# EAGLE design Main Board (EAGLE 9.2.2)
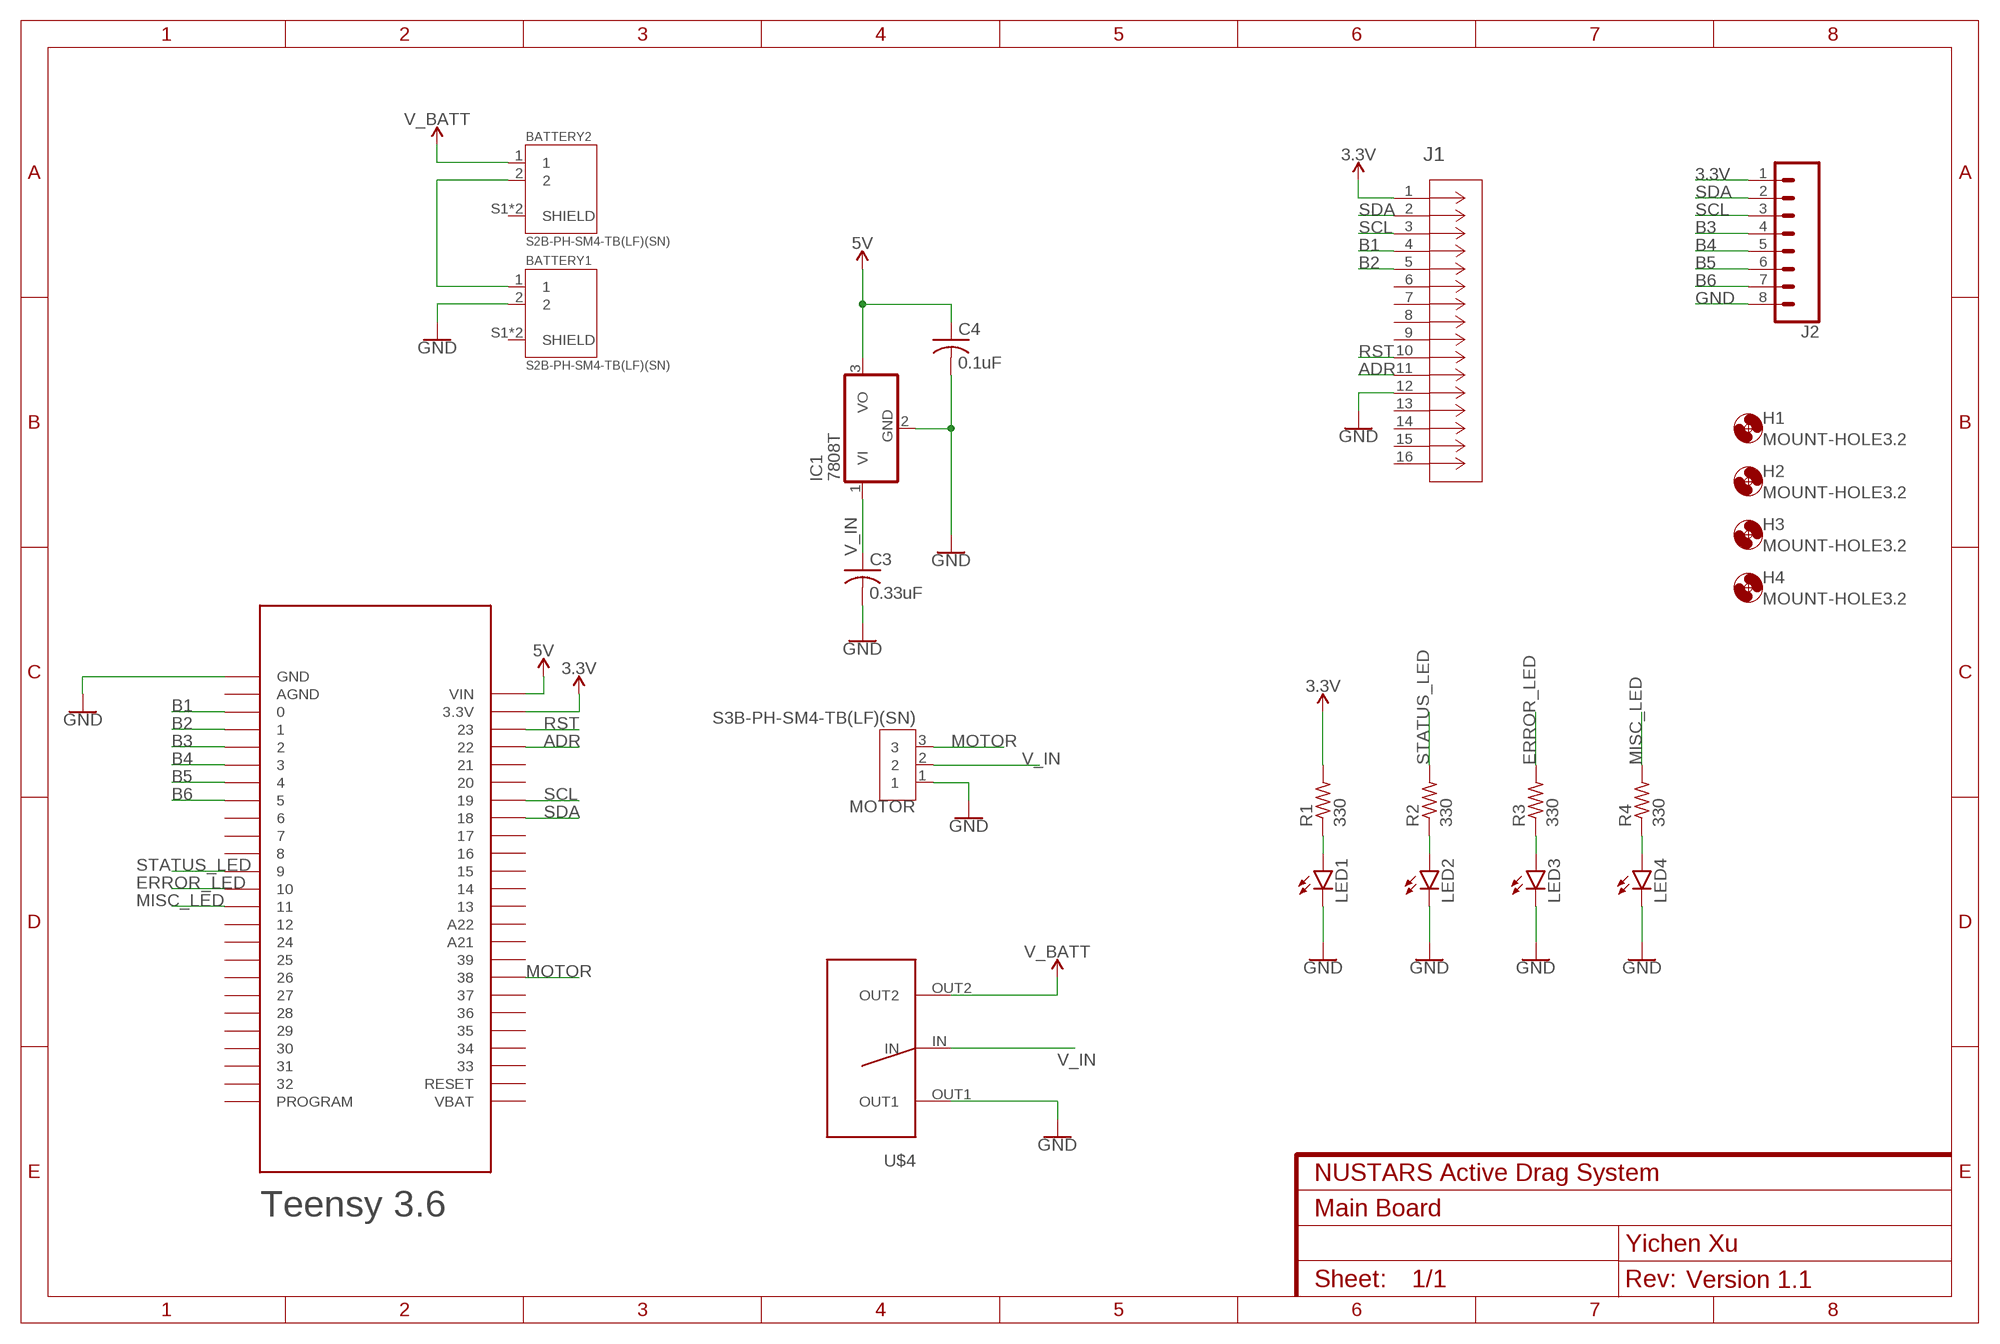
[diagram p0: schematic, sheet 1]
FRAME1 (FRAME-A4L): CNAME: NUSTARS Active Drag System; CREVISION: Version 1.1; DESIGNER: Yichen Xu

## Parts
BATTERY1  S2B-PH-SM4-TB(LF)(SN)  [JST_S2B-PH-SM4-TB(LF)(SN)]
BATTERY2  S2B-PH-SM4-TB(LF)(SN)  [JST_S2B-PH-SM4-TB(LF)(SN)]
C3  0.33uF  C-USC0805  [C0805]
C4  0.1uF  C-USC0805  [C0805]
H1  MOUNT-HOLE3.2  [3,2]
H2  MOUNT-HOLE3.2  [3,2]
H3  MOUNT-HOLE3.2  [3,2]
H4  MOUNT-HOLE3.2  [3,2]
IC1  7808T  [TO220H]
J1  62674-121121ALF  [CON12_1X12_DUT_58XF]
J2  CONN_08"  [1X08]
LED1  LEDSML0805  [SML0805]
LED2  LEDSML0805  [SML0805]
LED3  LEDSML0805  [SML0805]
LED4  LEDSML0805  [SML0805]
MOTOR  S3B-PH-SM4-TB(LF)(SN)  [JST_S3B-PH-SM4-TB(LF)(SN)]
R1  330  R-US_R0805  [R0805]
R2  330  R-US_R0805  [R0805]
R3  330  R-US_R0805  [R0805]
R4  330  R-US_R0805  [R0805]
U$1  TEENSY3.6  [TEENSY3.6]
U$4  SLIDE_SWITCH2  [SLIDE_SWITCH2]

## Nets
3.3V: J1.1 J2.1 R1.2 U$1.3.3V0(3.3V) U$1.3.3V1(3.3V) U$1.3.3V2(3.3V)
5V: C4.1 IC1.3(VO) U$1.VIN
ADR: J1.11 U$1.P22
B1: J1.4 U$1.P0
B2: J1.5 U$1.P1
B3: J2.4 U$1.P2
B4: J2.5 U$1.P3
B5: J2.6 U$1.P4
B6: J2.7 U$1.P5
ERROR_LED: R3.2 U$1.P10
GND: BATTERY1.2 C3.2 C4.2 IC1.2(GND) J1.12 J2.8 LED1.C LED2.C LED3.C LED4.C MOTOR.1 U$1.GND U$1.GND0(GND) U$1.GND2(GND) U$4.OUT1
MISC_LED: R4.2 U$1.P11
MOTOR: MOTOR.3 U$1.P38
N$1: LED1.A R1.1
N$2: BATTERY1.1 BATTERY2.2
N$4: LED2.A R2.1
N$5: LED3.A R3.1
N$6: LED4.A R4.1
RST: J1.10 U$1.P23
SCL: J1.3 J2.3 U$1.P19
SDA: J1.2 J2.2 U$1.P18
STATUS_LED: R2.2 U$1.P9
V_BATT: BATTERY2.1 U$4.OUT2
V_IN: C3.1 IC1.1(VI) MOTOR.2 U$4.IN
Unconnected: BATTERY1.S1(SHIELD) BATTERY1.S2(SHIELD) BATTERY2.S1(SHIELD) BATTERY2.S2(SHIELD) J1.6 J1.7 J1.8 J1.9 J1.13 J1.14 J1.15 J1.16 U$1.A21 U$1.A22 U$1.AGND U$1.P6 U$1.P7 U$1.P8 U$1.P12 U$1.P13 U$1.P14 U$1.P15 U$1.P16 U$1.P17 U$1.P20 U$1.P21 U$1.P24 U$1.P25 U$1.P26 U$1.P27 U$1.P28 U$1.P29 U$1.P30 U$1.P31 U$1.P32 U$1.P33 U$1.P34 U$1.P35 U$1.P36 U$1.P37 U$1.P39 U$1.PROGRAM U$1.RESET U$1.VBAT

## Library data of the parts
BATTERY1 BATTERY2 = S2B-PH-SM4-TB_LF__SN_:S2B-PH-SM4-TB(LF)(SN): PH Series 2 Position 2 mm Pitch Surface Mount Side Entry Shrouded Header; DESCRIPTION: PH Series 2 Position 2 mm Pitch Surface Mount Side Entry Shrouded Header; DIGI-KEY_PART_NUMBER: 455-1749-1-ND; DIGI-KEY_PURCHASE_URL: https://www.digikey.com/product-detail/en/jst-sales-america-inc/S2B-PH-SM4-TB_LF__SN_/455-1749-1-ND/926846?utm_source=snapeda&utm_medium=aggregator&utm_campaign=symbol; MF: JST Sales; MP: S2B-PH-SM4-TB_LF__SN_; PACKAGE: FakePackage u
C3 C4 = resistor:C-US: CAPACITOR, American symbol
H1-H4 = holes:MOUNT-HOLE: MOUNTING HOLE with drill center marker
IC1 = adafruit:78*: Positive VOLTAGE REGULATOR Added bigger pads to the TO-92 package
J1 = NUSTARS ADS Library:62674-121121ALF; MANUFACTURER_PART_NUMBER: 62674121121ALF; VENDOR: FCI
J2 = SparkFun-Connectors:CONN_08: Multi connection point. Often used as Generic Header-pin footprint for 0.1 inch spaced/style header connections On any of the 0.1 inch spaced packages, you can populate with these: Break Away Headers - Straight <https://www.sparkfun.com/products/116> (PRT-00116) Break Away Male Headers - Right Angle <https://www.sparkfun.com/products/553> (PRT-00553) Female Headers <https://www.sparkfun.com/products/115> (PRT-00115) Break Away Headers - Machine Pin <https://www.sparkfun.com/products/117> (PRT-00117) Break Away Female Headers - Swiss Machine Pin <https://www.sparkfun.com/products/743> (PRT-00743) Arduino Stackable Header - 8 Pin <https://www.sparkfun.com/products/9279> (PRT-09279) For SCREWTERMINALS and SPRING TERMINALS visit here: Screw Terimnals on SparkFun.com <https://www.sparkfun.com/search/results?term=Screw+Terminals> (5mm/3.5mm/2.54mm spacing) This device is also useful as a general connection point to wire up your design to another part of your project. Our various solder wires solder well into these plated through hole pads. Hook-Up Wire - Assortment (Stranded, 22 AWG) <https://www.sparkfun.com/products/11375> (PRT-11375) Hook-Up Wire - Assortment (Solid Core, 22 AWG) <https://www.sparkfun.com/products/11367> (PRT-11367) View the entire wire category on our website here <https://www.sparkfun.com/categories/141> Special notes: Molex polarized connector foot print use with SKU : PRT-08231 with associated crimp pins and housings. 1MM SMD Version SKU: PRT-10208 NOTES ON THE VARIANTS LOCK and LOCK_LONGPADS... This footprint was designed to help hold the alignment of a through-hole component (i.e. 6-pin header) while soldering it into place. You may notice that each hole has been shifted either up or down by 0.005 of an inch from it's more standard position (which is a perfectly straight line). This slight alteration caused the pins (the squares in the middle) to touch the edges of the holes. Because they are alternating, it causes a "brace" to hold the component in place. 0.005 has proven to be the perfect amount of "off-center" position when using our standard breakaway headers. Although looks a little odd when you look at the bare footprint, once you have a header in there, the alteration is very hard to notice. Also,if you push a header all the way into place, it is covered up entirely on the bottom side.; PROD_ID: CONN-08438
LED1-LED4 = led:LED: LED OSRAM: - CHIPLED LG R971, LG N971, LY N971, LG Q971, LY Q971, LO R971, LY R971 LH N974, LH R974 LS Q976, LO Q976, LY Q976 LO Q996 - Hyper CHIPLED LW Q18S LB Q993, LB Q99A, LB R99A - SideLED LS A670, LO A670, LY A670, LG A670, LP A670 LB A673, LV A673, LT A673, LW A673 LH A674 LY A675 LS A676, LA A676, LO A676, LY A676, LW A676 LS A679, LY A679, LG A679 - Hyper Micro SIDELED® LS Y876, LA Y876, LO Y876, LY Y876 LT Y87S - SmartLED LW L88C, LW L88S LB L89C, LB L89S, LG L890 LS L89K, LO L89K, LY L89K LS L896, LA L896, LO L896, LY L896 - TOPLED LS T670, LO T670, LY T670, LG T670, LP T670 LSG T670, LSP T670, LSY T670, LOP T670, LYG T670 LG T671, LOG T671, LSG T671 LB T673, LV T673, LT T673, LW T673 LH T674 LS T676, LA T676, LO T676, LY T676, LB T676, LH T676, LSB T676, LW T676 LB T67C, LV T67C, LT T67C, LS T67K, LO T67K, LY T67K, LW E67C LS E67B, LA E67B, LO E67B, LY E67B, LB E67C, LV E67C, LT E67C LW T67C LS T679, LY T679, LG T679 LS T770, LO T770, LY T770, LG T770, LP T770 LB T773, LV T773, LT T773, LW T773 LH T774 LS E675, LA E675, LY E675, LS T675 LS T776, LA T776, LO T776, LY T776, LB T776 LHGB T686 LT T68C, LB T68C - Hyper Mini TOPLED® LB M676 - Mini TOPLED Santana® LG M470 LS M47K, LO M47K, LY M47K Source: http://www.osram.convergy.de LUXEON: - LUMILED® LXK2-PW12-R00, LXK2-PW12-S00, LXK2-PW14-U00, LXK2-PW14-V00 LXK2-PM12-R00, LXK2-PM12-S00, LXK2-PM14-U00 LXK2-PE12-Q00, LXK2-PE12-R00, LXK2-PE12-S00, LXK2-PE14-T00, LXK2-PE14-U00 LXK2-PB12-K00, LXK2-PB12-L00, LXK2-PB12-M00, LXK2-PB14-N00, LXK2-PB14-P00, LXK2-PB14-Q00 LXK2-PR12-L00, LXK2-PR12-M00, LXK2-PR14-Q00, LXK2-PR14-R00 LXK2-PD12-Q00, LXK2-PD12-R00, LXK2-PD12-S00 LXK2-PH12-R00, LXK2-PH12-S00 LXK2-PL12-P00, LXK2-PL12-Q00, LXK2-PL12-R00 Source: www.luxeon.com KINGBRIGHT: KA-3528ASYC Source: www.kingbright.com
MOTOR = S3B-PH-SM4-TB_LF__SN_:S3B-PH-SM4-TB(LF)(SN): CONN HEADER PH SIDE 3POS 2MM SMD; DESCRIPTION: PH Series 3 Position 2.0 mm SMT Side Entry Shrouded Header; DIGI-KEY_PART_NUMBER: 455-1750-1-ND; DIGI-KEY_PURCHASE_URL: https://www.digikey.com/product-detail/en/jst-sales-america-inc/S3B-PH-SM4-TB_LF__SN_/455-1750-1-ND/926847?utm_source=snapeda&utm_medium=aggregator&utm_campaign=symbol; MF: JST Sales; MP: S3B-PH-SM4-TB_LF__SN_; PACKAGE: None
R1-R4 = resistor:R-US_: RESISTOR, American symbol
U$1 = NUSTARS ADS Library:TEENSY3.6
U$4 = ME433:SLIDE_SWITCH2

## Board
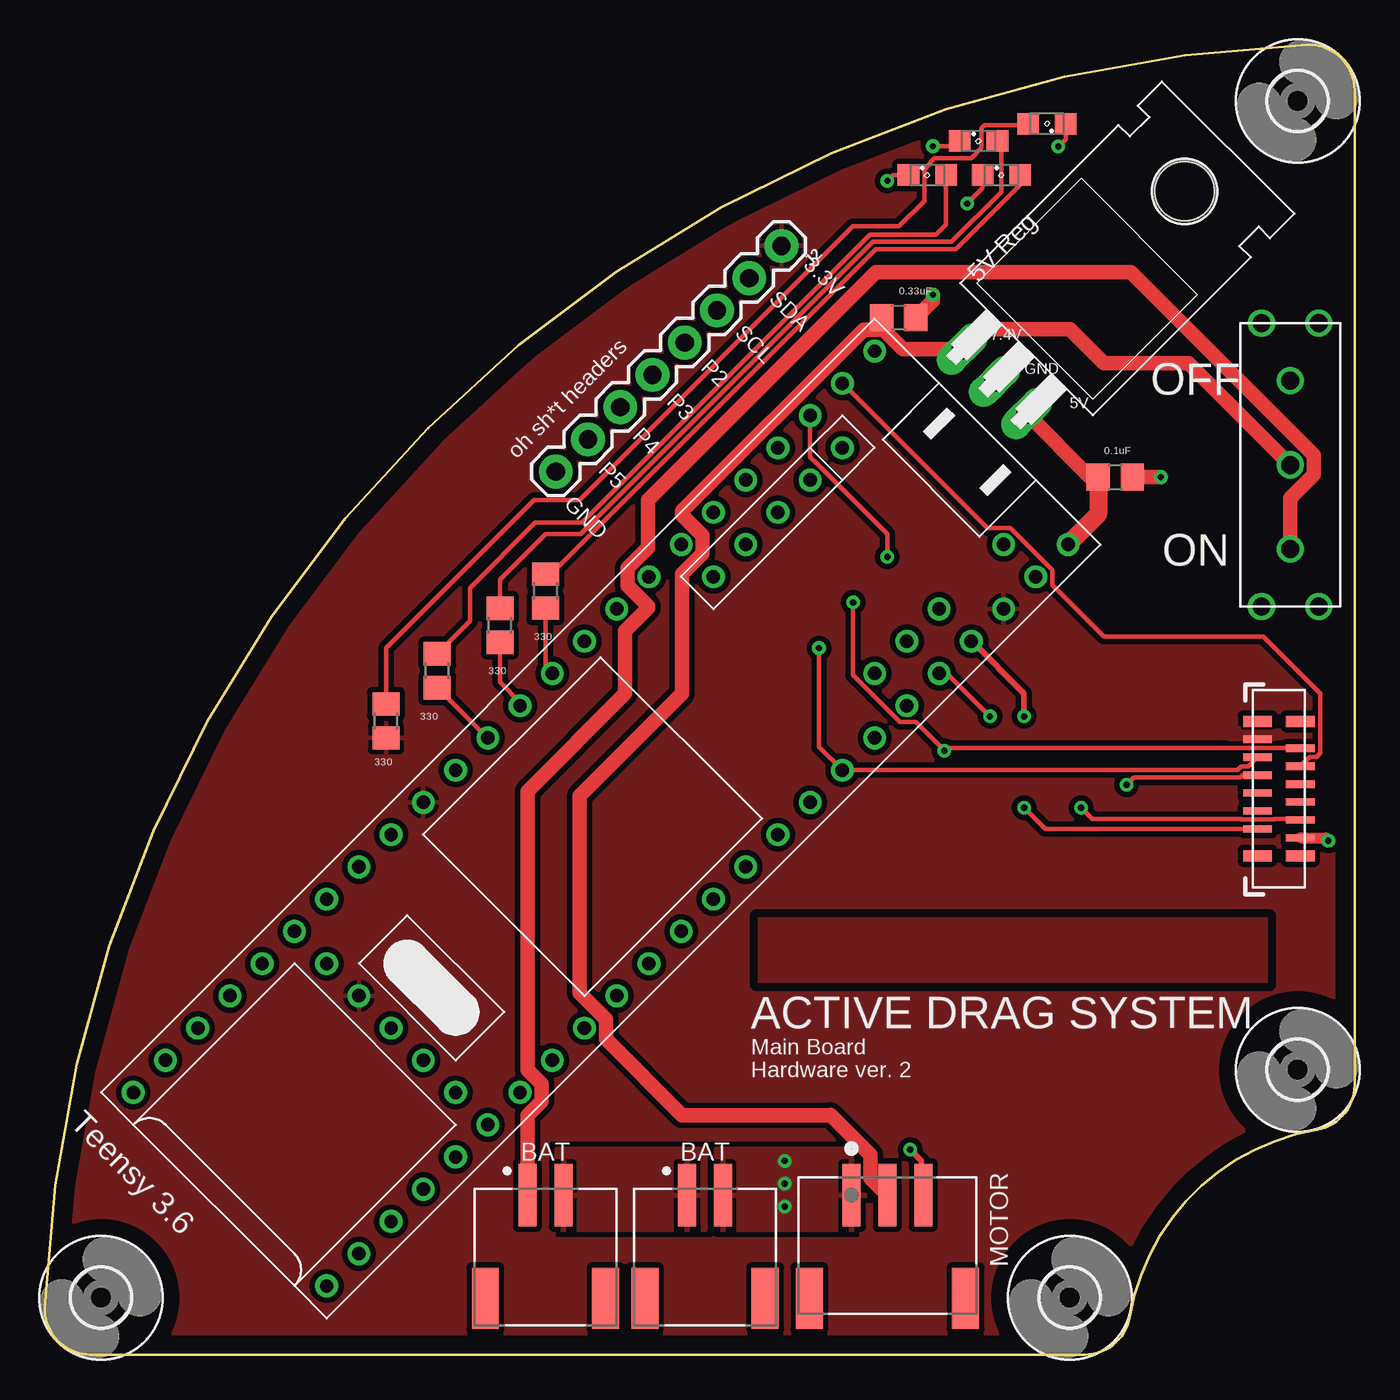
[diagram p1: board, top side]
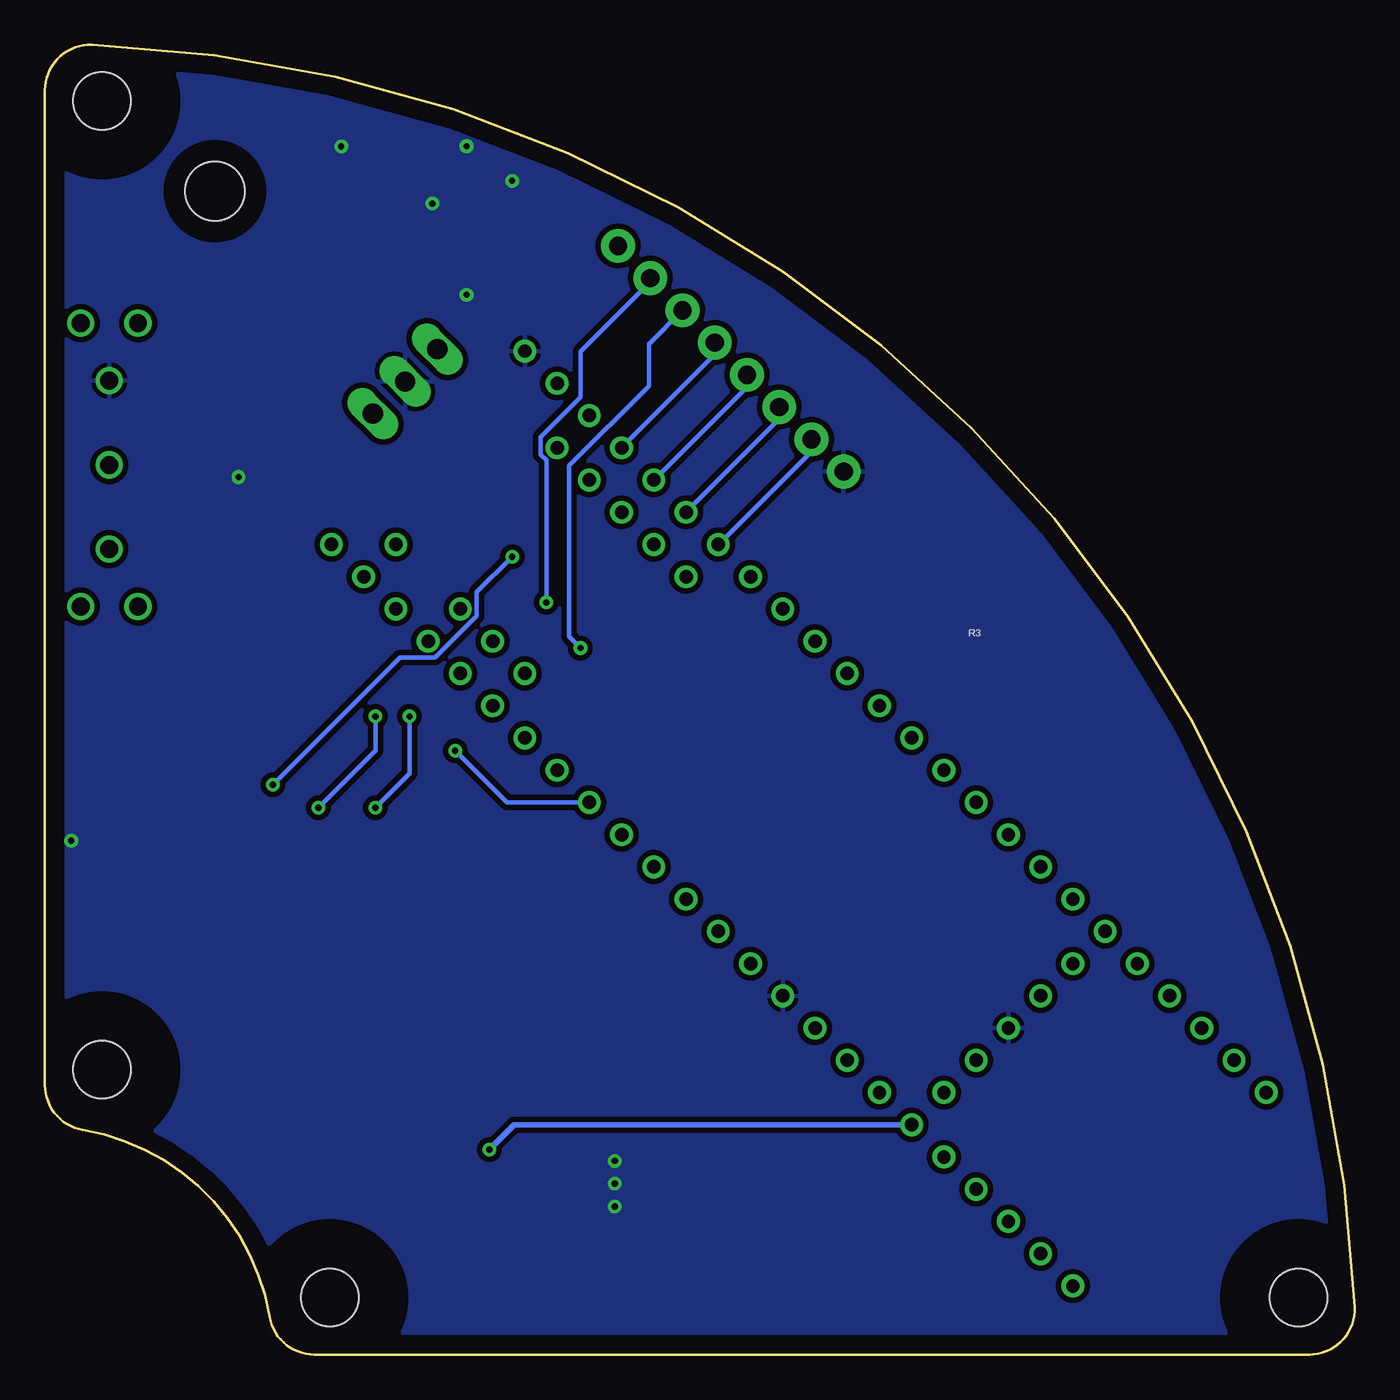
[diagram p2: board, bottom side, seen from below]

Size 72.98 x 72.98 mm. Coordinates in mm from the lower left corner, seen from the top.
Outline: 2.54,0 57.95,0 arc80 60.46,2.12 arc-71 70.86,12.52 arc80 72.98,15.03 72.98,70.44 arc92 70.35,72.98 arc86 0,2.63 arc92 2.54,0
Copper layers (1*16): Top 0.035mm / dielectric 1.5mm / Bottom 0.035mm
Design rules "default": minimum track width 6mil, minimum drill 0.35mm, track to track 6mil, track to pad 6mil, pad to pad 6mil, via to via 6mil, smd to smd 6mil, copper to edge 40mil, drill to drill 6mil, minimum pad ring 10mil, minimum via ring 8mil, stop-mask expansion 4mil, vias tented up to drill 0mil, thermal gap 10mil
tRestrict: 4 lines

### Footprints (pad centres in the part's own frame; a part is rotated, then mirrored left to right if it is on the bottom)
JST_S2B-PH-SM4-TB(LF)(SN) = smd 1 x 3.5: 1 -1,0; 2 1,0 | smd 1.5 x 3.4: S1 -3.35,-5.75; S2 3.35,-5.75
C0805 = smd 1.3 x 1.5: 1 -0.95,0; 2 0.95,0
3,2 = hole 3.2: 0,0
TO220H = drill 1.118 long: 1 -2.54,-10.16; 2 0,-10.16; 3 2.54,-10.16 | hole 3.302: 0,4.826
CON12_1X12_DUT_58XF = smd 0.406 x 1.6: 1 0,4.775; 2 -0.5,2.388; 3 -1,4.775; 4 -1.5,2.388; 5 -2,4.775; 6 -2.5,2.388; 7 -3,4.775; 8 -3.5,2.388; 9 -4,4.775; 10 -4.5,2.388; 11 -5,4.775; 12 -5.5,2.388 | smd 0.61 x 1.6: 13 -6.497,2.388; 14 0.997,2.388; 15 -6.497,4.775; 16 0.997,4.775
1X08 = drill 1.016 pad 1.88: 1 0,0; 2 2.54,0; 3 5.08,0; 4 7.62,0; 5 10.16,0; 6 12.7,0; 7 15.24,0; 8 17.78,0
SML0805 = smd 1.2 x 1.2: A 1.05,0; C -1.05,0
JST_S3B-PH-SM4-TB(LF)(SN) = smd 1 x 3.5: 1 2,0; 2 0,0; 3 -2,0 | smd 1.5 x 3.4: P1 -4.35,5.75; P2 4.35,5.75
R0805 = smd 1.3 x 1.5: 1 -0.95,0; 2 0.95,0
TEENSY3.6 = drill 0.75 pad 1.27: 3.3V0 16.51,54.61; 3.3V1 1.27,24.13; 3.3V2 6.35,13.97; A21 16.51,19.05; A22 16.51,21.59; AGND 16.51,57.15; GND 16.51,24.13; GND0 1.27,59.69; GND2 8.89,13.97; P0 1.27,57.15; P1 1.27,54.61; P2 1.27,52.07; P3 1.27,49.53; P4 1.27,46.99; P5 1.27,44.45; P6 1.27,41.91; P7 1.27,39.37; P8 1.27,36.83; P9 1.27,34.29; P10 1.27,31.75; P11 1.27,29.21; P12 1.27,26.67; P13 16.51,26.67; P14 16.51,29.21; P15 16.51,31.75; P16 16.51,34.29; P17 16.51,36.83; P18 16.51,39.37; P19 16.51,41.91; P20 16.51,44.45; P21 16.51,46.99; P22 16.51,49.53; P23 16.51,52.07; P24 1.27,21.59; P25 1.27,19.05; P26 1.27,16.51; P27 1.27,13.97; P28 1.27,11.43; P29 1.27,8.89; P30 1.27,6.35; P31 1.27,3.81; P32 1.27,1.27; P33 16.51,1.27; P34 16.51,3.81; P35 16.51,6.35; P36 16.51,8.89; P37 16.51,11.43; P38 16.51,13.97; P39 16.51,16.51; P$1 3.81,54.61; P$2 3.81,52.07; P$3 3.81,49.53; P$4 3.81,46.99; P$5 3.81,44.45; P$6 13.97,57.15; P$7 13.97,52.07; P$8 13.97,49.53; P$9 13.97,46.99; PROGRAM 11.43,13.97; RESET 13.97,13.97; VBAT 3.81,13.97; VIN 16.51,59.69
SLIDE_SWITCH2 = drill 1: 1 -7.899,1.6; 2 -7.899,-1.6; 3 7.899,1.6; 4 7.899,-1.6; IN 0,0; OUT1 -4.699,0; OUT2 4.699,0

### Placement (x,y rotation side)
BATTERY1  36.78,8.89 0 top
BATTERY2  27.89,8.89 0 top
C3  47.58,57.78 0 top
C4  59.64,48.9 0 top
H1  3.13,3.17 0 top
H2  57.1,3.17 0 top
H3  69.8,15.88 0 top
H4  69.8,69.85 0 top
IC1  60.09,61.41 315 top
J1  72.34,34.29 90 top
J2  41.04,61.78 225 top
LED1  55.83,68.58 180 top
LED2  53.29,65.72 0 top
LED3  52.02,67.63 0 top
LED4  49.17,65.72 0 top
MOTOR  46.94,8.89 180 top
R1  19,35.31 270 top
R2  27.89,42.55 270 top
R3  25.35,40.64 270 top
R4  21.86,38.1 270 top
U$1  3.13,14.61 315 top
U$4  69.39,49.58 270 top

### Tracks (layer width: path | path; a pad name or v marks a point on that pad's centre or on a via)
3.3V
  pour Top (isolate 0.305, rank 6): -0.05,0 60.28,0 72.98,12.7 72.98,13.34 72.98,73.03 42.5,73.03 -0.05,30.48
  pour Top (no thermals): 65.99,34.92 68.53,34.92 68.53,34.29 65.99,34.29
5V
  Top 0.813: C4.1 58.24,48.9 IC1.3
  Top 1.016: C4.1 58.69,46.82 U$1.VIN
ADR  (via drill 0.35)
  Top 0.254: J1.11 55.75,29.29 v54.56,30.48 | v52.66,35.56 50.26,37.95 U$1.P22
  Bottom 0.254: v54.56,30.48 52.66,32.38 v52.66,35.56
B1
  Top 0.254: J1.4 70.47,33.31 70.87,33.31 71.07,33.51 71.07,36.83 67.9,40.01 59.01,40.01 56.13,42.88 56.13,43.72 53.8,46.05 52.5,46.05 U$1.P0
B2  (via drill 0.35)
  Top 0.254: J1.5 66.74,32.29 66.61,32.16 60.69,32.16 v60.28,31.75 | v46.94,44.45 46.94,45.72 43.56,49.11 43.02,49.64 42.64,50.02 U$1.P1
  Bottom 0.254: v60.28,31.75 53.19,38.84 51.24,38.84 48.91,41.17 48.91,42.48 v46.94,44.45
B3
  Bottom 0.254: U$1.P2 35.65,55.72 J2.4
B4
  Bottom 0.254: U$1.P3 33.86,53.92 J2.5
B5
  Bottom 0.254: U$1.P4 32.06,52.12 J2.6
B6
  Bottom 0.254: U$1.P5 30.27,50.33 J2.7
DUMMY
  pour Top: 39.64,24.45 68.22,24.45 68.22,20.64 39.64,20.64
ERROR_LED
  Top 0.254: U$1.P10 26.48,36.34 25.35,37.47 R3.2
GND  (via drill 0.35)
  Top 0.254: LED2.C 52.24,64.99 v51.39,64.14 | LED3.C 50.68,67.33 v49.48,67.33 | LED4.C 47.26,65.72 v46.94,65.41 | LED1.C 56.88,67.72 v56.47,67.31
  Top 0.61: J1.12 71.35,28.79 v71.51,28.63
  Top 0.813: v49.48,59.05 49.48,58.74 C3.2 | C4.2 v62.18,48.9
  other vias: 41.23,10.79 41.23,9.53 41.23,8.26
  pour Top (isolate 0.305, rank 2): 37.42,6.99 37.42,11.43 45.04,11.43 45.67,10.79 45.67,6.99
  pour Bottom (isolate 0.305, rank 6): -0.05,0 60.28,0 72.98,12.7 72.98,13.34 72.98,73.03 42.5,73.03 0.59,31.11 -0.05,30.48
MISC_LED
  Top 0.254: U$1.P11 21.89,37.15 R4.2
MOTOR  (via drill 0.35)
  Top 0.305: v48.21,11.43 48.85,10.79 48.85,8.98 MOTOR.3
  Bottom 0.305: U$1.P38 46.83,12.81 v48.21,11.43
N$1
  Top 0.254: R1.1 19,39.37 27.26,47.62 29.8,47.62 45.04,62.87 47.58,62.87 48.99,64.28 48.99,66.04 49.34,66.38 49.34,66.44 49.57,66.67 51.62,66.67 52.19,67.25 52.19,68.34 52.36,68.51 54.71,68.51 LED1.A
N$2
  pour Top (isolate 0.305, rank 5): 28.53,11.43 28.53,6.99 36.78,6.99 36.78,11.43
N$4
  Top 0.254: R2.1 28.21,43.49 46.31,61.59 50.75,61.59 54.34,65.19 LED2.A
N$5
  Top 0.254: R3.1 25.35,43.18 27.89,45.72 29.86,45.72 46.14,62 50.52,62 53.29,64.77 53.29,67.41 LED3.A
N$6
  Top 0.254: R4.1 23.69,40.88 23.69,42.73 27.32,46.35 29.92,46.35 45.97,62.41 49.66,62.41 50.22,62.96 LED4.A
RST  (via drill 0.35)
  Top 0.254: J1.10 69.9,29.84 68.52,29.84 68.48,29.81 66.65,29.81 66.61,29.84 58.37,29.84 v57.74,30.48
  Top 0.305: v54.56,35.56 54.56,36.83 51.64,39.75 U$1.P23
  Bottom 0.254: v57.74,30.48 54.56,33.66 v54.56,35.56
SCL  (via drill 0.35)
  Top 0.254: J1.3 67.05,32.77 66.65,32.77 66.44,32.57 U$1.P19 43.13,33.87 v43.13,39.37
  Bottom 0.254: v43.13,39.37 43.77,40.01 43.77,49.53 39.32,53.98 39.32,56.32 J2.3
SDA  (via drill 0.35)
  Top 0.254: J1.2 50.25,33.79 v50.12,33.66 48.53,35.24 47.65,35.24 45.04,37.86 v45.04,41.91
  Bottom 0.254: v50.12,33.66 47.23,30.77 U$1.P18 | J2.2 39.32,59.91 39.32,59.69 43.13,55.88 43.13,53.34 45.35,51.12 45.35,50.15 45.04,49.83 v45.04,41.91
STATUS_LED
  Top 0.254: U$1.P9 27.89,38.33 R2.2
V_BATT
  Top 0.813: BATTERY2.1 26.89,13.33 27.67,14.11 27.67,15.1 26.89,15.88 26.89,31.39 32.34,36.83 32.34,40.33 33.61,41.6 33.61,41.71 32.47,42.85 32.47,43.84 33.61,44.98 33.61,47.62 46.31,60.33 60.5,60.33 70.7,50.12 70.7,49.03 69.39,47.72 U$4.OUT2
V_IN
  Top 0.813: MOTOR.2 46,9.83 46,11.14 43.79,13.35 43.77,13.34 35.51,13.34 31.26,17.59 31.26,18.69 29.8,20.16 29.8,31.11 35.51,36.83 35.51,43.51 36.65,44.64 36.65,45.63 35.51,46.77 35.51,46.99 45.63,57.11 46.73,57.11 | U$4.IN 63.72,55.24 59.01,55.24 57.1,57.15 52.24,57.15 IC1.1 47.81,56.02 46.73,57.11 | C3.1 46.63,57.21 46.73,57.11

### Text on the board
tPlace: 3.3V | 5V Reg | SDA | SCL | 7.4V | P2 | GND | OFF | P3 | 5V | P4 | oh sh*t headers | P5 | GND | ON | 330 | 330 | 330 | 330 | ACTIVE DRAG SYSTEM | Main Board | Hardware ver. 2 | BAT | BAT | MOTOR
bPlace: R3
202bmp: C:/Users/ichis/Pictures/NUSTARS Logo PNG.bmp